# EAGLE design ChargerLED (EAGLE 6.1)
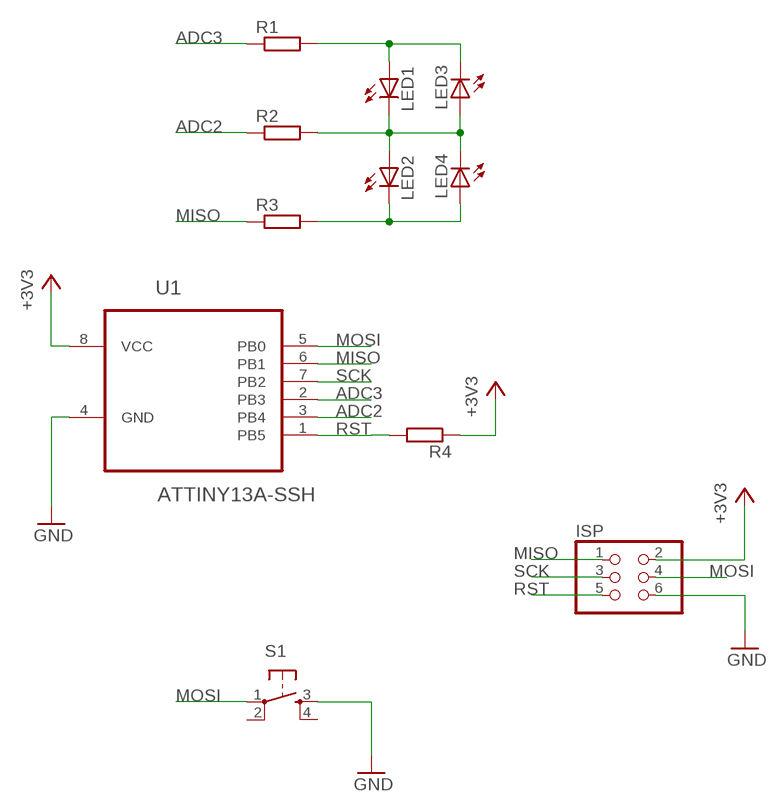
[diagram p0: schematic, sheet 1]

## Parts
ISP  PINHD-2X3  [2X03]
LED1  LEDCHIP-LED0603  [CHIP-LED0603]
LED2  LEDCHIP-LED0603  [CHIP-LED0603]
LED3  LEDCHIP-LED0603  [CHIP-LED0603]
LED4  LEDCHIP-LED0603  [CHIP-LED0603]
R1  R-EU_R0603  [R0603]
R2  R-EU_R0603  [R0603]
R3  R-EU_R0603  [R0603]
R4  R-EU_R0603  [R0603]
S1  TAC_SWITCHSMD  [TACTILE_SWITCH_SMD]
U1  ATTINY13A-SSH  [SOIC127P600X175-8N]

## Nets
+3V3: ISP.2 R4.1 U1.8(VCC)
ADC2: R2.1 U1.3(PB4)
ADC3: R1.1 U1.2(PB3)
GND: ISP.6 S1.3 U1.4(GND)
MISO: ISP.1 R3.1 U1.6(PB1)
MOSI: ISP.4 S1.1 U1.5(PB0)
N$1: LED1.C LED2.A LED3.A LED4.C R2.2
N$2: LED2.C LED4.A R3.2
N$4: LED1.A LED3.C R1.2
RST: ISP.5 R4.2 U1.1(PB5)
SCK: ISP.3 U1.7(PB2)
Unconnected: S1.2 S1.4

## Library data of the parts
ISP = pinhead:PINHD-2X3: PIN HEADER
LED1-LED4 = adafruit:LED: LED OSRAM: - CHIPLED LG R971, LG N971, LY N971, LG Q971, LY Q971, LO R971, LY R971 LH N974, LH R974 LS Q976, LO Q976, LY Q976 LO Q996 - Hyper CHIPLED LW Q18S LB Q993, LB Q99A, LB R99A - SideLED LS A670, LO A670, LY A670, LG A670, LP A670 LB A673, LV A673, LT A673, LW A673 LH A674 LY A675 LS A676, LA A676, LO A676, LY A676, LW A676 LS A679, LY A679, LG A679 - Hyper Micro SIDELED® LS Y876, LA Y876, LO Y876, LY Y876 LT Y87S - SmartLED LW L88C, LW L88S LB L89C, LB L89S, LG L890 LS L89K, LO L89K, LY L89K LS L896, LA L896, LO L896, LY L896 - TOPLED LS T670, LO T670, LY T670, LG T670, LP T670 LSG T670, LSP T670, LSY T670, LOP T670, LYG T670 LG T671, LOG T671, LSG T671 LB T673, LV T673, LT T673, LW T673 LH T674 LS T676, LA T676, LO T676, LY T676, LB T676, LH T676, LSB T676, LW T676 LB T67C, LV T67C, LT T67C, LS T67K, LO T67K, LY T67K, LW E67C LS E67B, LA E67B, LO E67B, LY E67B, LB E67C, LV E67C, LT E67C LW T67C LS T679, LY T679, LG T679 LS T770, LO T770, LY T770, LG T770, LP T770 LB T773, LV T773, LT T773, LW T773 LH T774 LS E675, LA E675, LY E675, LS T675 LS T776, LA T776, LO T776, LY T776, LB T776 LHGB T686 LT T68C, LB T68C - Hyper Mini TOPLED® LB M676 - Mini TOPLED Santana® LG M470 LS M47K, LO M47K, LY M47K Source: http://www.osram.convergy.de/
R1-R4 = resistor:R-EU_: RESISTOR, European symbol
S1 = SparkFun-Electromechanical:TAC_SWITCH: Momentary Switch Button commonly used for reset or general input. Spark Fun Electronics SKU : COM-00097 SMT- SWCH-08247; PROD_ID: SWCH-08247
U1 = Atmel_By_element14_Batch_1:ATTINY13A-SSH: 8-bit Microcontroller with In-System Programmable Flash; MPN: ATTINY13A-SSH; OC_FARNELL: 1715519; OC_NEWARK: 15R0301; PACKAGE: SOIC-8; SUPPLIER: Atmel

## Board
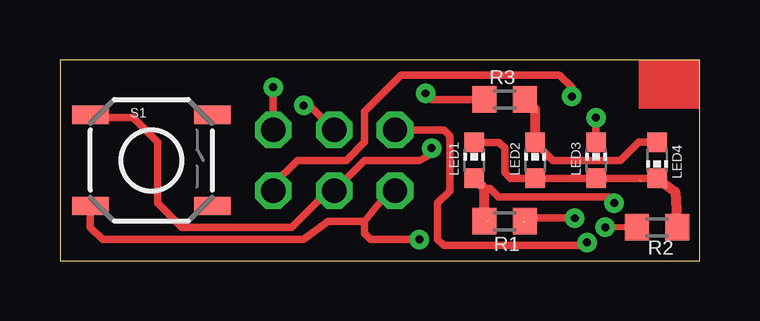
[diagram p1: board, top side]
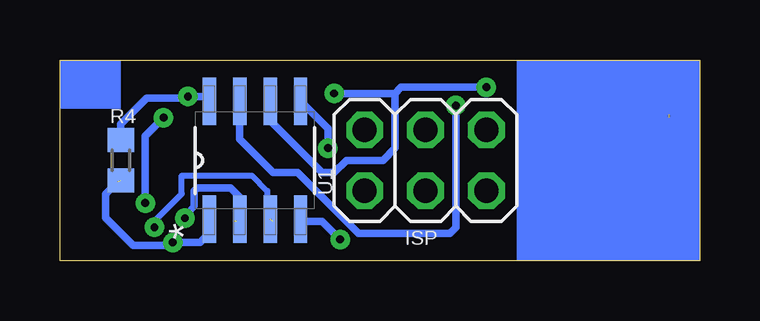
[diagram p2: board, bottom side, seen from below]

Size 26.67 x 8.38 mm. Coordinates in mm from the lower left corner, seen from the top.
Outline: 0,0 26.67,0 26.67,8.38 0,8.38 0,0
Copper layers (1*16): Top 0.0356mm / dielectric 1.5011mm / Bottom 0.0356mm
Design rules: minimum track width 6mil, minimum drill 13mil, track to track 6mil, track to pad 6mil, pad to pad 6mil, via to via 6mil, smd to smd 6mil, copper to edge 15mil, drill to drill 6mil, minimum pad ring 7mil, minimum via ring 7mil, stop-mask expansion 0mil, vias tented up to drill 100mil, thermal gap 10mil

### Footprints (pad centres in the part's own frame; a part is rotated, then mirrored left to right if it is on the bottom)
2X03 = drill 1.016 octagon: 1 -2.54,-1.27; 2 -2.54,1.27; 3 0,-1.27; 4 0,1.27; 5 2.54,-1.27; 6 2.54,1.27
CHIP-LED0603 = smd 0.8 x 0.8: A 0,-0.75; C 0,0.75
R0603 = smd 1 x 1.1: 1 -0.85,0; 2 0.85,0
TACTILE_SWITCH_SMD = smd 1.524 x 0.762: 1 -2.54,1.905; 2 2.54,1.905; 3 -2.54,-1.905; 4 2.54,-1.905
SOIC127P600X175-8N = smd 1.981 x 0.559: 1 -2.464,1.905; 2 -2.464,0.635; 3 -2.464,-0.635; 4 -2.464,-1.905; 5 2.464,-1.905; 6 2.464,-0.635; 7 2.464,0.635; 8 2.464,1.905

### Placement (x,y rotation side)
ISP  11.43,4.19 180 bottom
LED1  17.27,4.19 0 top
LED2  19.81,4.19 0 top
LED3  22.35,4.19 0 top
LED4  24.89,4.19 180 top
R1  18.54,1.65 180 top
R2  24.89,1.4 0 top
R3  18.54,6.73 0 top
R4  24.13,4.19 270 bottom
S1  3.81,4.19 0 top
U1  18.54,4.19 90 bottom

### Tracks (layer width: path | path; a pad name or v marks a point on that pad's centre or on a via)
+3V3  (via drill 0.33 pad 0.81)
  Top 0.305: ISP.2 8.89,3.17 9.91,4.19 10.67,4.19 10.92,4.19 11.94,4.19 12.7,4.95 12.7,6.22 14.22,7.75 20.83,7.75 21.34,7.24 v21.34,6.86
  Bottom 0.305: R4.1 24.13,5.71 23.06,6.78 21.54,6.78 v21.34,6.86 20.65,6.86 U1.8 20.52,6.73
ADC2  (via drill 0.33 pad 0.81)  (1 unrouted)
  Top 0.254: R2.1 23.62,1.4 v22.73,1.4
  Bottom 0.254: 17.78,1.65 18.03,1.91 18.03,2.92 18.67,3.56 21.59,3.56 21.59,2.79 22.73,1.65
  Bottom 0.305: v22.73,1.4 22.73,1.65
ADC3  (via drill 0.33 pad 0.81)  (1 unrouted)
  Top 0.305: v21.46,1.78 19.43,1.78 19.3,1.65
  Bottom 0.305: U1.2 19.18,2.67 19.56,3.05 20.95,3.05 21.08,2.92 21.08,2.29 v21.46,1.78
GND  (via drill 0.33 pad 0.81)
  Top 0.305: ISP.6 13.72,2.92 12.7,1.65 | 12.7,1.65 12.7,1.14 12.95,0.89 14.73,0.89 v14.99,0.89 | 12.7,1.65 11.18,1.65 10.16,0.89 1.78,0.89 1.27,1.4 S1.3
  Bottom 0.305: v14.99,0.89 15.75,1.65 16.56,1.65 U1.4
MISO  (via drill 0.33 pad 0.81)
  Top 0.305: v8.89,7.24 ISP.1 | R3.1 15.49,6.73 v15.24,6.99
  Bottom 0.305: U1.6 17.91,5.84 15.75,3.68 15.24,3.68 14.73,4.19 13.21,4.19 12.7,4.7 12.7,6.99 | 12.7,6.99 12.45,7.24 v8.89,7.24 | v15.24,6.99 12.7,6.99
MOSI  (via drill 0.33 pad 0.81)  (1 unrouted)
  Top 0.305: v15.49,4.7 15.49,4.45 14.99,4.19 12.7,4.19 ISP.4 11.18,2.92 9.65,1.4 5.08,1.4 4.06,2.41 4.06,4.95 3.05,5.97 1.27,5.97
  Bottom 0.305: v15.49,4.7 15.49,5.51 U1.5
N$1
  Top 0.305: LED1.C 18.3,4.94 18.54,4.7 18.54,3.68 18.78,3.44 LED2.A LED3.A | 22.36,3.43 24.88,3.43 LED4.C
  Top 0.406: LED3.A 22.36,3.43 | LED4.C 25.65,2.88 R2.2
N$2
  Top 0.305: LED2.C 20.56,4.19 21.08,4.19 22.86,4.19 23.37,4.19 24.13,4.95 24.88,4.95
  Top 0.406: R3.2 19.81,6.31 LED2.C | 24.88,4.95 LED4.A
N$4  (via drill 0.33 pad 0.81)
  Top 0.305: 17.69,3.02 17.93,3.02 18.29,2.67 22.73,2.67 | 22.73,2.67 v23.11,2.41 22.86,2.67 22.73,2.67 | v22.35,5.97 LED3.C
  Top 0.406: R1.2 17.69,3.02 LED1.A
  Bottom 0.305: v23.11,2.41 23.11,5.21 v22.35,5.97
RST  (via drill 0.33 pad 0.81)  (1 unrouted)
  Top 0.305: ISP.5 16,5.46 16.26,5.21 16.26,2.92 15.75,2.41 15.75,0.89 16,0.64 20.57,0.64 21.34,0.64 21.84,0.64 v21.97,0.76
  Bottom 0.305: 24.26,3.3 24.77,2.79 24.77,1.78 23.62,0.64 22.1,0.64 v21.97,0.76 20.83,0.76 20.45,1.14 U1.1
SCK  (via drill 0.33 pad 0.81)
  Top 0.305: v10.16,6.48 10.41,6.48 ISP.3
  Bottom 0.305: U1.7 19.18,5.08 17.78,3.68 16.76,3.68 16.26,3.17 14.22,1.14 10.41,1.14 10.16,1.4 v10.16,6.48
(copper drawn outside any net)
  shapes: Bottom area x2, Top area x1